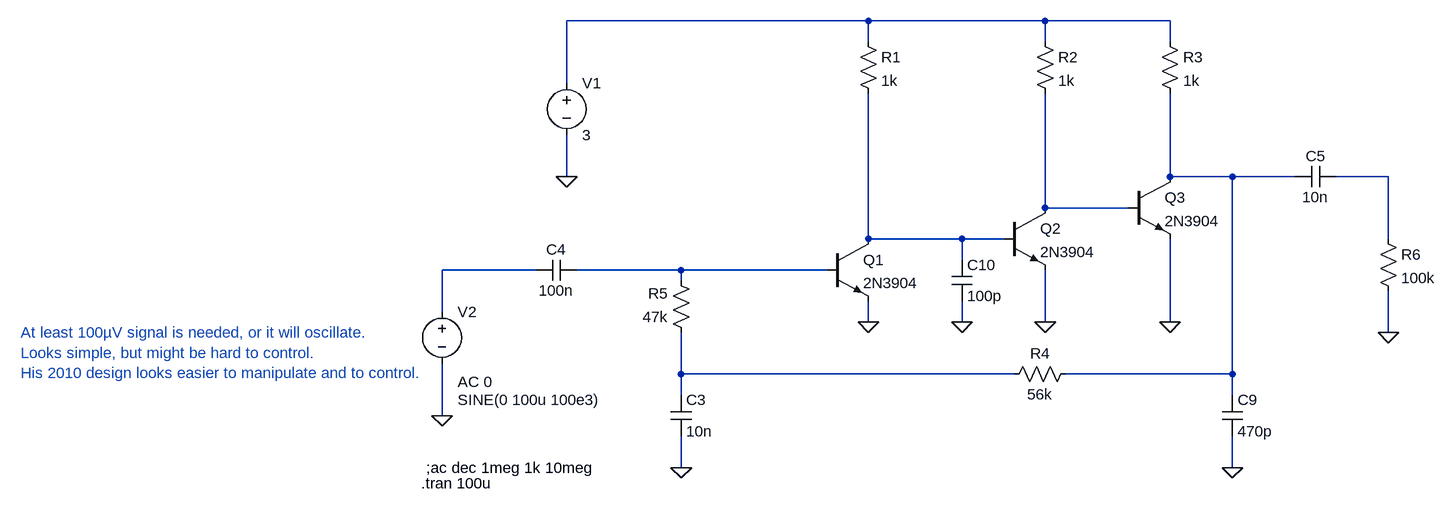
[diagram p0: schematic AlanYatesAdventCalendar2014.asc]
AlanYatesAdventCalendar2014.asc, the LTspice schematic file:
Version 4
SHEET 1 3216 680
WIRE 288 -224 -176 -224
WIRE 560 -224 288 -224
WIRE 752 -224 560 -224
WIRE 288 -192 288 -224
WIRE 560 -192 560 -224
WIRE 752 -192 752 -224
WIRE -176 -128 -176 -224
WIRE -176 16 -176 -48
WIRE 752 16 752 -112
WIRE 848 16 752 16
WIRE 944 16 848 16
WIRE 1088 16 1008 16
WIRE 560 64 560 -112
WIRE 688 64 560 64
WIRE 288 112 288 -112
WIRE 432 112 288 112
WIRE 496 112 432 112
WIRE 1088 112 1088 16
WIRE 432 144 432 112
WIRE -224 160 -368 160
WIRE 0 160 -160 160
WIRE 224 160 0 160
WIRE 0 176 0 160
WIRE -368 224 -368 160
WIRE 288 240 288 208
WIRE 432 240 432 208
WIRE 560 240 560 160
WIRE 752 240 752 112
WIRE 1088 256 1088 192
WIRE 0 320 0 256
WIRE 512 320 0 320
WIRE 848 320 848 16
WIRE 848 320 592 320
WIRE 0 352 0 320
WIRE 848 352 848 320
WIRE -368 384 -368 304
WIRE 0 464 0 416
WIRE 848 464 848 416
FLAG -176 16 0
FLAG -368 384 0
FLAG 0 464 0
FLAG 288 240 0
FLAG 560 240 0
FLAG 752 240 0
FLAG 1088 256 0
FLAG 848 464 0
FLAG 432 240 0
SYMBOL voltage -176 -144 R0
SYMATTR InstName V1
SYMATTR Value 3
SYMBOL voltage -368 208 R0
WINDOW 3 24 152 Left 2
WINDOW 123 24 124 Left 2
WINDOW 39 0 0 Left 0
SYMATTR Value SINE(0 100u 100e3)
SYMATTR Value2 AC 0
SYMATTR InstName V2
SYMBOL npn 224 112 R0
SYMATTR InstName Q1
SYMATTR Value 2N3904
SYMBOL res 272 -208 R0
SYMATTR InstName R1
SYMATTR Value 1k
SYMBOL npn 496 64 R0
SYMATTR InstName Q2
SYMATTR Value 2N3904
SYMBOL res 544 -208 R0
SYMATTR InstName R2
SYMATTR Value 1k
SYMBOL npn 688 16 R0
SYMATTR InstName Q3
SYMATTR Value 2N3904
SYMBOL res 736 -208 R0
SYMATTR InstName R3
SYMATTR Value 1k
SYMBOL cap -16 352 R0
SYMATTR InstName C3
SYMATTR Value 10n
SYMBOL res 608 304 R90
WINDOW 0 0 56 VBottom 2
WINDOW 3 32 56 VTop 2
SYMATTR InstName R4
SYMATTR Value 56k
SYMBOL res 16 272 R180
WINDOW 0 36 76 Left 2
WINDOW 3 36 40 Left 2
SYMATTR InstName R5
SYMATTR Value 47k
SYMBOL cap -160 144 R90
WINDOW 0 0 32 VBottom 2
WINDOW 3 32 32 VTop 2
SYMATTR InstName C4
SYMATTR Value 100n
SYMBOL cap 1008 0 R90
WINDOW 0 0 32 VBottom 2
WINDOW 3 32 32 VTop 2
SYMATTR InstName C5
SYMATTR Value 10n
SYMBOL res 1072 96 R0
SYMATTR InstName R6
SYMATTR Value 100k
SYMBOL cap 832 352 R0
SYMATTR InstName C9
SYMATTR Value 470p
SYMBOL cap 416 144 R0
SYMATTR InstName C10
SYMATTR Value 100p
TEXT -400 488 Left 2 !.tran 100u
TEXT -392 464 Left 2 !;ac dec 1meg 1k 10meg
TEXT -1016 256 Left 2 ;At least 100µV signal is needed, or it will oscillate.\nLooks simple, but might be hard to control.\nHis 2010 design looks easier to manipulate and to control.

The netlist it stands for:
* AlanYatesAdventCalendar2014.asc
V1 N001 0 3
V2 N006 0 SINE(0 100u 100e3) AC 0
Q1 N005 N007 0 0 2N3904
R1 N001 N005 1k
Q2 N004 N005 0 0 2N3904
R2 N001 N004 1k
Q3 N002 N004 0 0 2N3904
R3 N001 N002 1k
C3 N008 0 10n
R4 N002 N008 56k
R5 N008 N007 47k
C4 N007 N006 100n
C5 N003 N002 10n
R6 N003 0 100k
C9 N002 0 470p
C10 N005 0 100p
.model NPN NPN
.model PNP PNP
.lib standard.bjt
.tran 100u
;ac dec 1meg 1k 10meg
* At least 100µV signal is needed, or it will oscillate.
* Looks simple, but might be hard to control.
* His 2010 design looks easier to manipulate and to control.
.backanno
.end